# Altium schematic sheet Interface.SchDoc
size 420 x 297 mm; DocumentNumber: 5; SheetNumber: 5; SheetTotal: 13; DecimalNumber: СНАБ.468222.001 ЭЗ
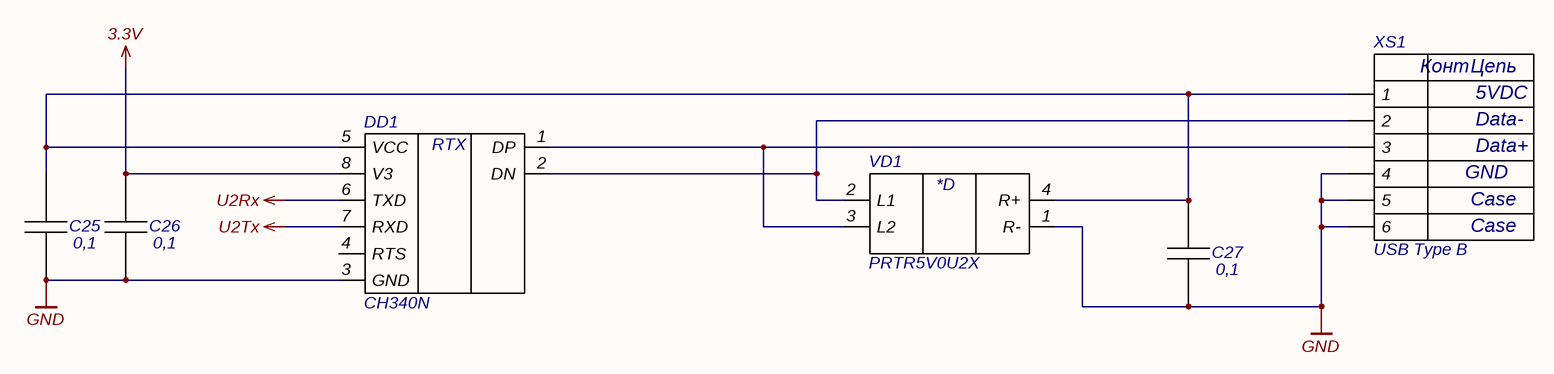
[diagram p0: Interface.SchDoc]

## Parts
C25  0,1  [C0603]
C26  0,1  [C0603]
C27  0,1  [C0603]
DD1  CH340N  [SOP-8 (SOIC)]
VD1  PRTR5V0U2X  [SOT-143]
XS1  USB Type B  [USB Type B]

## Nets
3.3V: C26.2 DD1.8(V3)
GND: C25.1 C26.1 C27.1 DD1.3(GND) VD1.1(R-) XS1.4 XS1.5 XS1.6
U2Rx: DD1.6(TXD)
U2Tx: DD1.7(RXD)
NetC25_2: C25.2 C27.2 DD1.5(VCC) VD1.4(R+) XS1.1
NetDD1_1: DD1.1(DP) VD1.3(L2) XS1.3
NetDD1_2: DD1.2(DN) VD1.2(L1) XS1.2

Not connected (* = marked no-connect by the designer): DD1 4(RTS)

## Notes on the sheet
- Подп. и дата
- Инв.№ дубл.
- Взам.инв.№
- Подп.и дата
- Инв.№ подл.
- Изм.
- Лист
- № докум.
- Подп.
- Дата
- Копировал
- Формат  A3
- (in symbol CH340N) RTX
- (in symbol PRTR5V0U2X) *D
- (in symbol USB Type B) Конт; Цепь; 5VDC; Data-; Data+; GND; Case

## Library data of the parts
C25-C27 = Chip Capasitor: Чип-конденсатор; Value: 0,1
DD1 = CH340N: Преобразователь интерфейса USB в UART; Manufacturer: Nanjing Qinheng Microelectronics; Case: SOP-8; Name: CH340N; Datasheet: https://static.chipdip.ru/lib/375/DOC030375417.pdf
VD1 = PRTR5V0U2X: Защитная диодная сборка от статического заряда; Manufacturer: UTD Semiconductor (UMW); Case: SOT-143; Name: PRTR5V0U2X; Datasheet: https://static.chipdip.ru/lib/303/DOC021303242.pdf
XS1 = USB Type B: Гнездо USB тип B; Manufacturer: Connfly electronic (Zhenqin); Name: USBB-1J; Case: USBB-1J (DS1099-W); Datasheet: https://static.chipdip.ru/lib/252/DOC051252493.pdf